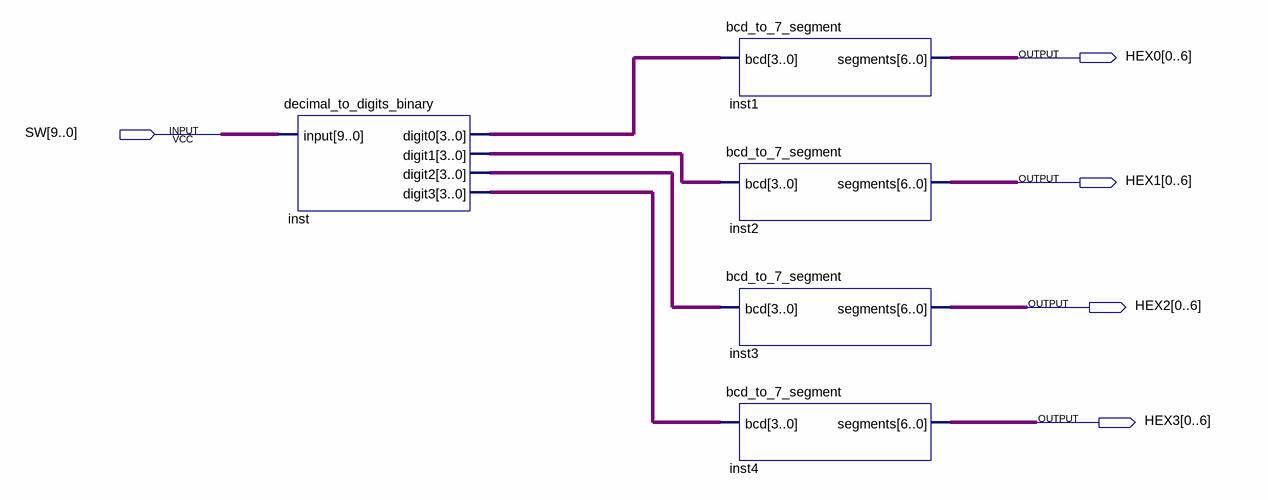
[diagram p0: schematic sheet]
// Quartus schematic dtdb_bdf.bdf as structural Verilog: 5 symbols, 5 pins
module dtdb_bdf (
  input  [9:0] SW,
  output [0:6] HEX0,
  output [0:6] HEX1,
  output [0:6] HEX2,
  output [0:6] HEX3
);

  wire [3:0] inst_digit0, inst_digit1, inst_digit2, inst_digit3;

  decimal_to_digits_binary inst (
    .\input (SW), .digit0(inst_digit0), .digit1(inst_digit1), .digit2(inst_digit2), .digit3(inst_digit3));
  bcd_to_7_segment inst1 (.bcd(inst_digit0), .segments(HEX0));
  bcd_to_7_segment inst2 (.bcd(inst_digit1), .segments(HEX1));
  bcd_to_7_segment inst3 (.bcd(inst_digit2), .segments(HEX2));
  bcd_to_7_segment inst4 (.bcd(inst_digit3), .segments(HEX3));
endmodule
